# Altium schematic sheet Accessories.SchDoc: Accessories
size B; Author: Craig Hesling; DrawnBy: Craig Hesling & Anh Luong; Revision: 1.3
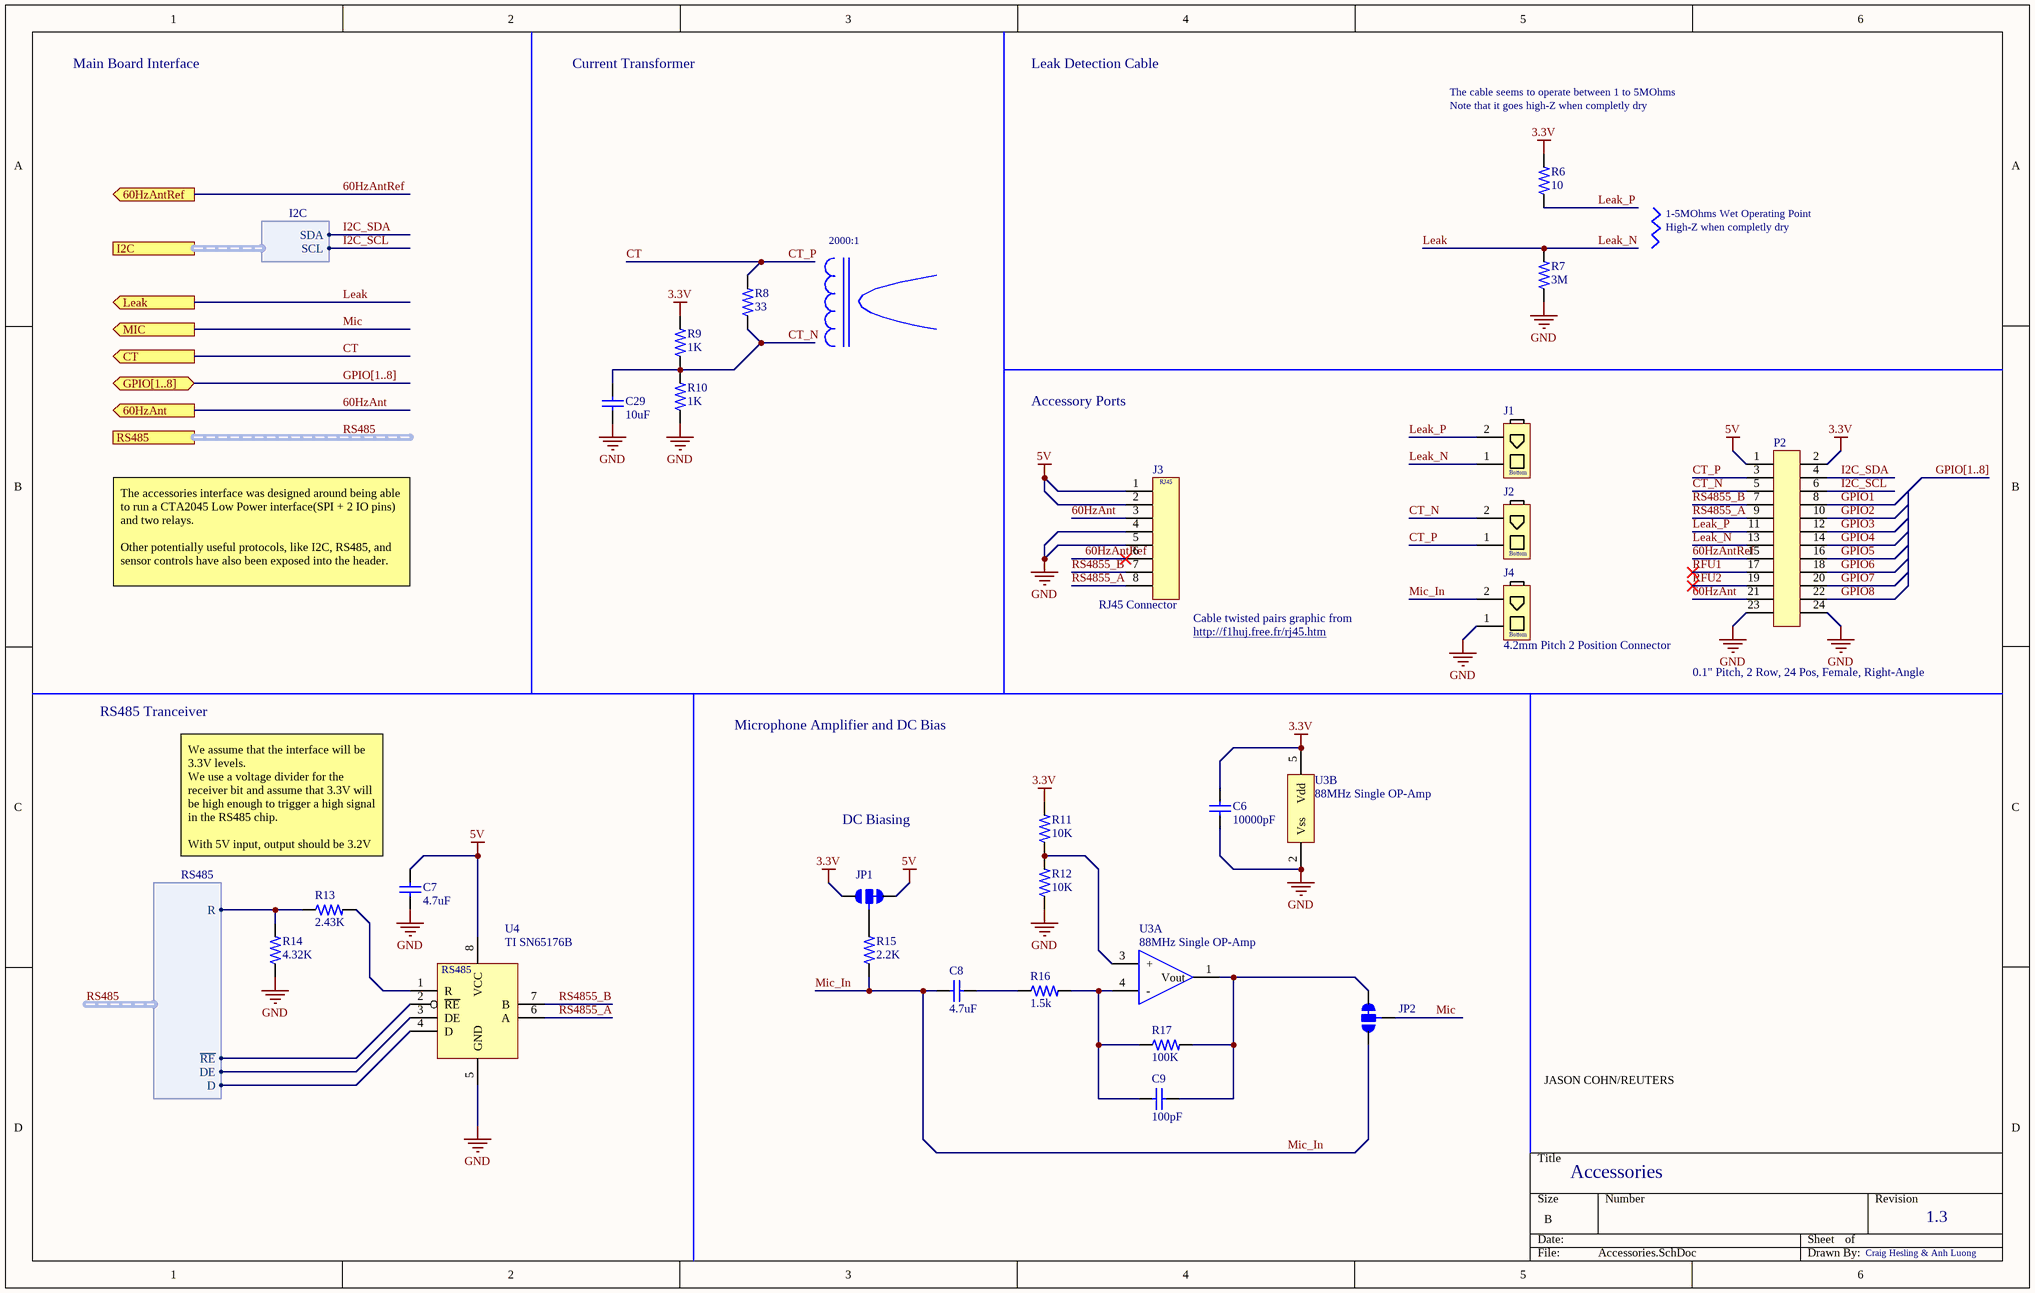
[diagram p0: Accessories.SchDoc]

## Parts
C6  10000pF  [CAPC1608X09L - CAP0603]
C7  4.7uF  [CAPC1608X09L - CAP0603]
C8  4.7uF  [CAPC1608X09L - CAP0603]
C9  100pF  [CAPC1608X09L - CAP0603]
C29  10uF  [CAPC1608X09L - CAP0603]
J1  4.2mm Pitch 2 Position Connector  [2POS 4.2MM PITCH RIGHT ANGLE]  (value not drawn)
J2  4.2mm Pitch 2 Position Connector  [2POS 4.2MM PITCH RIGHT ANGLE]  (value not drawn)
J3  RJ45 Connector  [RJ45 Unshielded PTH Connector]
J4  4.2mm Pitch 2 Position Connector  [2POS 4.2MM PITCH RIGHT ANGLE]
JP1  JUMPER-PAD-3-2OF3_NC_BY_TRACE_SMALL  [PAD-JUMPER-3-2OF3_NC_BY_TRACE_YES_SILK_FULL_BOX]  (value not drawn)
JP2  JUMPER-PAD-3-2OF3_NC_BY_TRACE_SMALL  [PAD-JUMPER-3-2OF3_NC_BY_TRACE_YES_SILK_FULL_BOX]  (value not drawn)
P2  0.1" Pitch, 2 Row, 24 Pos, Female, Right-Angle  [0.1 inch 2 row 24 pos female right-angle header Sullins]
R6  10  [RESC1608X06L - RES0603]
R7  3M  [RESC1608X06L - RES0603]
R8  33  [RESC1608X06L - RES0603]
R9  1K  [RESC1608X06L - RES0603]
R10  1K  [RESC1608X06L - RES0603]
R11  10K  [RESC1608X06L - RES0603]
R12  10K  [RESC1608X06L - RES0603]
R13  2.43K  [RESC1608X06L - RES0603]
R14  4.32K  [RESC1608X06L - RES0603]
R15  2.2K  [RESC1608X06L - RES0603]
R16  1.5k  [RESC1608X06L - RES0603]
R17  100K  [RESC1608X06L - RES0603]
U3  88MHz Single OP-Amp  [SOT95P280X145-5L]  (parts A,B of 2)
U4  TI SN65176B  [SOIC127P600X175-8L]

## Ports
60HzAnt (out), 60HzAntRef (out), CT (out), GPIO[1..8] (bidir), I2C (harness I2C), Leak (out), MIC (out), RS485 (harness RS485)

## Harnesses
I2C: SDA, SCL
RS485: R, ~{RE}, DE, D

## Nets
3.3V: C6.2 JP1.1 P2.2 R6.2 R9.2 R11.2 U3.5(Vdd)
5V: C7.2 J3.1 J3.2 JP1.3 P2.1 U4.8(VCC)
GND: C6.1 C7.1 C29.1 J3.4 J3.5 J4.1(Bottom) P2.23 P2.24 R7.1 R10.1 R12.1 R14.1 U3.2(Vss) U4.5(GND)
60HzAnt: J3.3 P2.21 ; port 60HzAnt
60HzAntRef: J3.6 P2.15 ; port 60HzAntRef
CT: J2.1(Bottom) P2.3 R8.2 ; port CT  [also labelled CT_P]
CT_N: C29.2 J2.2(Top) P2.5 R8.1 R9.1 R10.2
GPIO1: P2.8
GPIO2: P2.10
GPIO3: P2.12
GPIO4: P2.14
GPIO5: P2.16
GPIO6: P2.18
GPIO7: P2.20
GPIO8: P2.22
I2C_SCL: P2.6 ; port I2C.SCL
I2C_SDA: P2.4 ; port I2C.SDA
Leak: J1.1(Bottom) P2.13 R7.2 ; port Leak  [also labelled Leak_N]
Leak_P: J1.2(Top) P2.11 R6.1
Mic: JP2.2 ; port MIC
Mic_In: C8.1 J4.2(Top) JP2.1 R15.1
RFU1: P2.17
RFU2: P2.19
RS485.D: U4.4(D) ; port RS485.D
RS485.DE: U4.3(DE) ; port RS485.DE
RS485.R: R13.1 R14.2 ; port RS485.R
RS485.~{RE}: U4.2(~{RE}) ; port RS485.~{RE}
RS4855_A: J3.8 P2.9 U4.6(A)
RS4855_B: J3.7 P2.7 U4.7(B)
NetC8_2: C8.2 R16.1
NetC9_1: C9.1 R16.2 R17.1 U3.4(-)
NetC9_2: C9.2 JP2.3 R17.2 U3.1(Vout)
NetJP1_2: JP1.2 R15.2
NetR11_1: R11.1 R12.2 U3.3(+)
NetR13_2: R13.2 U4.1(R)

## Buses and harness runs
bus GPIO[1..8]
bus GPIO[1..8] = port GPIO[1..8]
harness RS485 = port RS485

## Notes on the sheet
- Main Board Interface
- Current Transformer
- Leak Detection Cable
- The cable seems to operate between 1 to 5MOhms
- Note that it goes high-Z when completly dry
- 1-5MOhms Wet Operating Point
- High-Z when completly dry
- 2000:1
- Accessory Ports
- The accessories interface was designed around being able to run a CTA2045 Low Power interface(SPI + 2 IO pins) and two relays.
  Other potentially useful protocols, like I2C, RS485, and sensor controls have also been exposed into the header.
- http://f1huj.free.fr/rj45.htm
- (near J3) Cable twisted pairs graphic from
- RS485 Tranceiver
- Microphone Amplifier and DC Bias
- DC Biasing
- We assume that the interface will be 3.3V levels.
  We use a voltage divider for the receiver bit and assume that 3.3V will be high enough to trigger a high signal in the RS485 chip.
  With 5V input, output should be 3.2V at 0A
- JASON COHN/REUTERS
- (in symbol SN65176B) RS485

## Library data of the parts
C6 = CAP0603 10000pF 10% 50V X7R: SMT 0603 Ceramic Capacitor; TempCoeff: X7R; Tolerance: 10%; Voltage: 50V; Value: 10000pF; Supplier 1: Digi-Key; Supplier 2: Digi-Key; Supplier 3: Digi-Key; Supplier Part Number 1: 478-1215-1-ND; Supplier Part Number 2: 311-1080-1-ND; Supplier Part Number 3: 490-1494-1-ND
C7 C8 = CAP0603 4.7uF 10% 6.3V X7R: SMT 0603 Ceramic Capacitor; TempCoeff: X7R; Tolerance: 10%; Voltage: 6.3V; Value: 4.7uF; Supplier 1: Digi-Key; Supplier Part Number 1: 1276-2087-1-ND
C9 = CAP0603 100pF 5% 50V NP0: SMT 0603 Ceramic Capacitor; TempCoeff: NP0; Tolerance: 5%; Voltage: 50V; Value: 100pF; Supplier 1: Digi-Key; Supplier 2: Digi-Key; Supplier Part Number 1: 399-1061-1-ND; Supplier Part Number 2: 490-1427-1-ND
C29 = CAP0603 10uF 20% 6.3V X5R: SMT 0603 Ceramic Capacitor; TempCoeff: X5R; Tolerance: 20%; Voltage: 6.3V; Value: 10uF; Supplier 1: Digi-Key; Supplier 2: Digi-Key; Supplier Part Number 1: 587-1256-1-ND; Supplier Part Number 2: 490-3896-1-ND
J1 J2 J4 = 2POS 4.2mm Pitch Right Angle: TE 1586043-2 - 2position 4.2mm pitch right angle with screw support; Positions: 2; Supplier 1: Digi-Key; Supplier Part Number 1: A30626-ND
J3 = RJ45 Unshielded PTH Connector: Amphenol RJ45 Unshielded Through-Hole Connector; Manufacturer: Amphenol FCI; Manufacturer Part Number: 54601-908WPLF; Contact Resistance: 30mR; Current Rating: 1A; Voltage Rating: 1kV; Number of Positions: 8; Number of Ports: 1; Insulation Resistance: 500MR; Direction: Down; Gender: Male; Pitch: 2.54mm; Supplier 1: Digi-Key; Supplier Part Number 1: 609-5081-ND; Supplier 2: Mouser; Stock 2: 0; Pricing 2: 1=0.51, 10=0.377, 50=0.377, 100=0.362, 1000=0.26, 10000=0.212 (USD); Mount: Through Hole; Contact Plating: Nickel,Gold; Contact Material: Bronze,Copper; Colour: Black; Housing Colour: Black; Housing Material: Polyamide; Min Operating Temperature: -65°C; Max Operating Temperature: 125°C; Termination: Through Hole; Orientation: Right Angle; Packaging: Rail/Tube; Shielding: Unshielded; Package Quantity: 200; Number of Rows: 1; Connector Type: RJ45; Number of Contacts: 8; Number of Positions Loaded: 8; Length: 15.24mm; Depth: 18mm; Radiation Hardening: No; REACH SVHC: No SVHC; Lead Free: Lead Free; Flammability Rating: UL94 V-0; ComponentLink1URL: https://datasheet.ciiva.com/9396/c-bmj-0051-9396388.pdf; ComponentLink1Description: https://datasheet.ciiva.com/9396/c-bmj-0051-9396388.pdf; ComponentLink2URL: https://datasheet.ciiva.com/26824/getdatasheetpartid-465238-26824373.pdf; ComponentLink2Description: https://datasheet.ciiva.com/26824/getdatasheetpartid-465238-26824373.pdf; ComponentLink3URL: https://datasheet.ciiva.com/1108/c-bmj-0051-1108424.pdf; ComponentLink3Description: https://datasheet.ciiva.com/1108/c-bmj-0051-1108424.pdf; ComponentLink4URL: https://datasheet.ciiva.com/15058/c-bmj-0051-15058750.pdf; ComponentLink4Description: https://datasheet.ciiva.com/15058/c-bmj-0051-15058750.pdf; ComponentLink5URL: https://datasheet.ciiva.com/16650/c-bmj-0051-16650286.pdf; ComponentLink5Description: https://datasheet.ciiva.com/16650/c-bmj-0051-16650286.pdf; ComponentLink6URL: https://datasheet.ciiva.com/7629/c-bmj-0051-7629183.pdf; ComponentLink6Description: https://datasheet.ciiva.com/7629/c-bmj-0051-7629183.pdf; Supplier Part Number 2: 649-54601-908WPLF
P2 = 0.1" 2 row 24 position female right-angle header sullins: Sullins 0.1" 2 row 24 position female right-angle header; Rows: 2; Positions: 24; Pitch: 2.54mm; Supplier 1: Digi-Key; Supplier 2: Digi-Key; Supplier Part Number 1: S5526-ND; Supplier Part Number 2: S5565-ND
R6 = RES0603 10 1% 1/10W: SMT 0603 Ceramic Resistor; Power: 1/10W; Tolerance: 1%; Value: 10; Supplier 1: Digi-Key; Supplier 2: Digi-Key; Supplier 3: Digi-Key; Supplier Part Number 1: 311-10.0HRCT-ND; Supplier Part Number 2: RMCF0603FT10R0CT-ND; Supplier Part Number 3: CR0603-FX-10R0ELFCT-ND
R7 = RES0603 3M 1% 1/10W: SMT 0603 Ceramic Resistor; Tolerance: 1%; Power: 1/10W; Value: 3M; Supplier 1: Digi-Key; Supplier 2: Digi-Key; Supplier 3: Digi-Key; Supplier Part Number 1: 541-3.00MHCT-ND; Supplier Part Number 2: RMCF0603FT3M00CT-ND; Supplier Part Number 3: 1276-4958-1-ND
R8 = RES0603 33 1% 1/10W: SMT 0603 Ceramic Resistor; Power: 1/10W; Tolerance: 1%; Value: 33; Supplier 1: Digi-Key; Supplier 2: Digi-Key; Supplier 3: Digi-Key; Supplier Part Number 1: 311-33.0HRCT-ND; Supplier Part Number 2: RMCF0603FT33R0CT-ND; Supplier Part Number 3: P33.0HCT-ND
R9 R10 = RES0603 1K 1% 1/10W: SMT 0603 Ceramic Resistor; Power: 1/10W; Tolerance: 1%; Value: 1K; Supplier 1: Digi-Key; Supplier 2: Digi-Key; Supplier 3: Digi-Key; Supplier Part Number 1: 311-1.00KHRCT-ND; Supplier Part Number 2: P1.00KHCT-ND; Supplier Part Number 3: RMCF0603FG1K00CT-ND
R11 R12 = RES0603 10K 1% 1/10W: SMT 0603 Ceramic Resistor; Power: 1/10W; Tolerance: 1%; Supplier 1: Digi-Key; Supplier 2: Digi-Key; Supplier 3: Digi-Key; Supplier Part Number 1: 311-10.0KHRCT-ND; Supplier Part Number 2: RMCF0603FT10K0CT-ND; Supplier Part Number 3: P10.0KHCT-ND; Value: 10K
R13 = RES0603 2.43K 1% 1/10W: SMT 0603 Ceramic Resistor; Power: 1/10W; Tolerance: 1%; Value: 2.43K; Supplier 1: Digi-Key; Supplier 2: Mouser; Supplier Part Number 1: 311-2.43KHRDKR-ND; Supplier Part Number 2: 603-RC0603FR-072K43L
R14 = RES0603 4.32K 1% 1/10W: SMT 0603 Ceramic Resistor; Power: 1/10W; Tolerance: 1%; Value: 4.32K; Supplier 1: Digi-Key; Supplier 2: Digi-Key; Supplier 3: Digi-Key; Supplier Part Number 1: 311-4.32KHRTR-ND; Supplier Part Number 2: P4.32KHCT-ND; Supplier Part Number 3: CRCW06034K32FKEB-ND
R15 = RES0603 2.2K 1% 1/10W: SMT 0603 Ceramic Resistor; Power: 1/10W; Tolerance: 1%; Value: 2.2K; Supplier 1: Digi-Key; Supplier Part Number 1: 311-2.20KHRCT-ND
R16 = RES0603 1.5K 1% 1/10W: SMT 0603 Ceramic Resistor; Power: 1/10W; Tolerance: 1%; Value: 1.5k; Supplier 1: Digi-Key; Supplier 2: Digi-Key; Supplier Part Number 1: 311-1.50KHRCT-ND; Supplier Part Number 2: RMCF0603FT1K50CT-ND
R17 = RES0603 100K 1% 1/10W: SMT 0603 Ceramic Resistor; Power: 1/10W; Tolerance: 1%; Value: 100K; Supplier 1: Digi-Key; Supplier Part Number 1: 311-100KHRCT-ND
U3 = LMV793MF/NOPB: TI LMV793MF/NOPB 88MHz Single OP-Amp; Slew Rate: 35 V/us; Bandwidth: 88MHz; Supplier 1: Digi-Key; Supplier Part Number 1: LMV793MF/NOPBCT-ND
U4 = SN65176B: Half Duplex RS485 Tranceiver; Supplier 1: Digi-Key; Supplier 2: Mouser; Supplier Part Number 1: 296-14636-1-ND; Supplier Part Number 2: 595-SN65176BDR